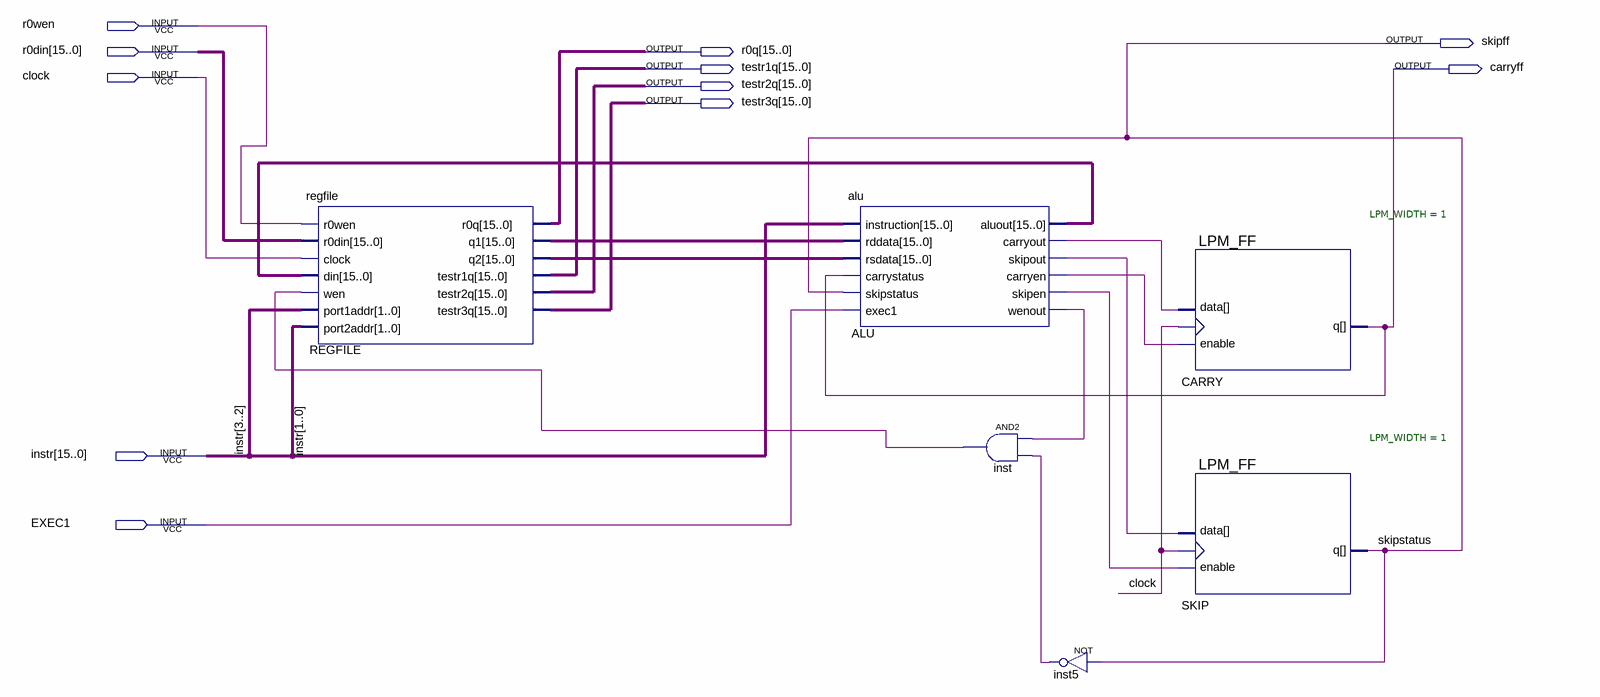
[diagram p0: schematic sheet]
// Quartus schematic top.bdf as structural Verilog: 6 symbols, 11 pins
module top (
  input  r0wen,
  input  [15:0] r0din,
  input  clock,
  input  [15:0] instr,
  input  EXEC1,
  output skipff,
  output [15:0] r0q,
  output [15:0] testr1q,
  output carryff,
  output [15:0] testr2q,
  output [15:0] testr3q
);

  wire ALU_carryen, ALU_carryout, ALU_skipen, ALU_skipout, ALU_wenout, inst5_out, inst_out;
  wire [15:0] ALU_aluout, REGFILE_q1, REGFILE_q2;

  regfile REGFILE (
    .r0wen(r0wen), .r0din(r0din), .clock(clock), .din(ALU_aluout), .wen(inst_out), .port1addr(instr[3:2]),
    .port2addr(instr[1:0]), .r0q(r0q), .q1(REGFILE_q1), .q2(REGFILE_q2), .testr1q(testr1q),
    .testr2q(testr2q), .testr3q(testr3q));
  alu ALU (
    .instruction(instr), .rddata(REGFILE_q1), .rsdata(REGFILE_q2), .carrystatus(carryff),
    .skipstatus(skipff), .exec1(EXEC1), .aluout(ALU_aluout), .carryout(ALU_carryout), .skipout(ALU_skipout),
    .carryen(ALU_carryen), .skipen(ALU_skipen), .wenout(ALU_wenout));
  and inst (inst_out, ALU_wenout, inst5_out);
  not inst5 (inst5_out, skipff);
  LPM_FF #(.LPM_WIDTH(1)) CARRY (.clock(clock), .data(ALU_carryout), .enable(ALU_carryen), .q(carryff));
  LPM_FF #(.LPM_WIDTH(1)) SKIP (.clock(clock), .data(ALU_skipout), .enable(ALU_skipen), .q(skipff));

  // Other names for the same wires on the sheet: skipstatus = skipff
endmodule
